# Altium schematic sheet Sheet1.SchDoc
size 381 x 241 mm; SheetNumber: 1; SheetTotal: 1
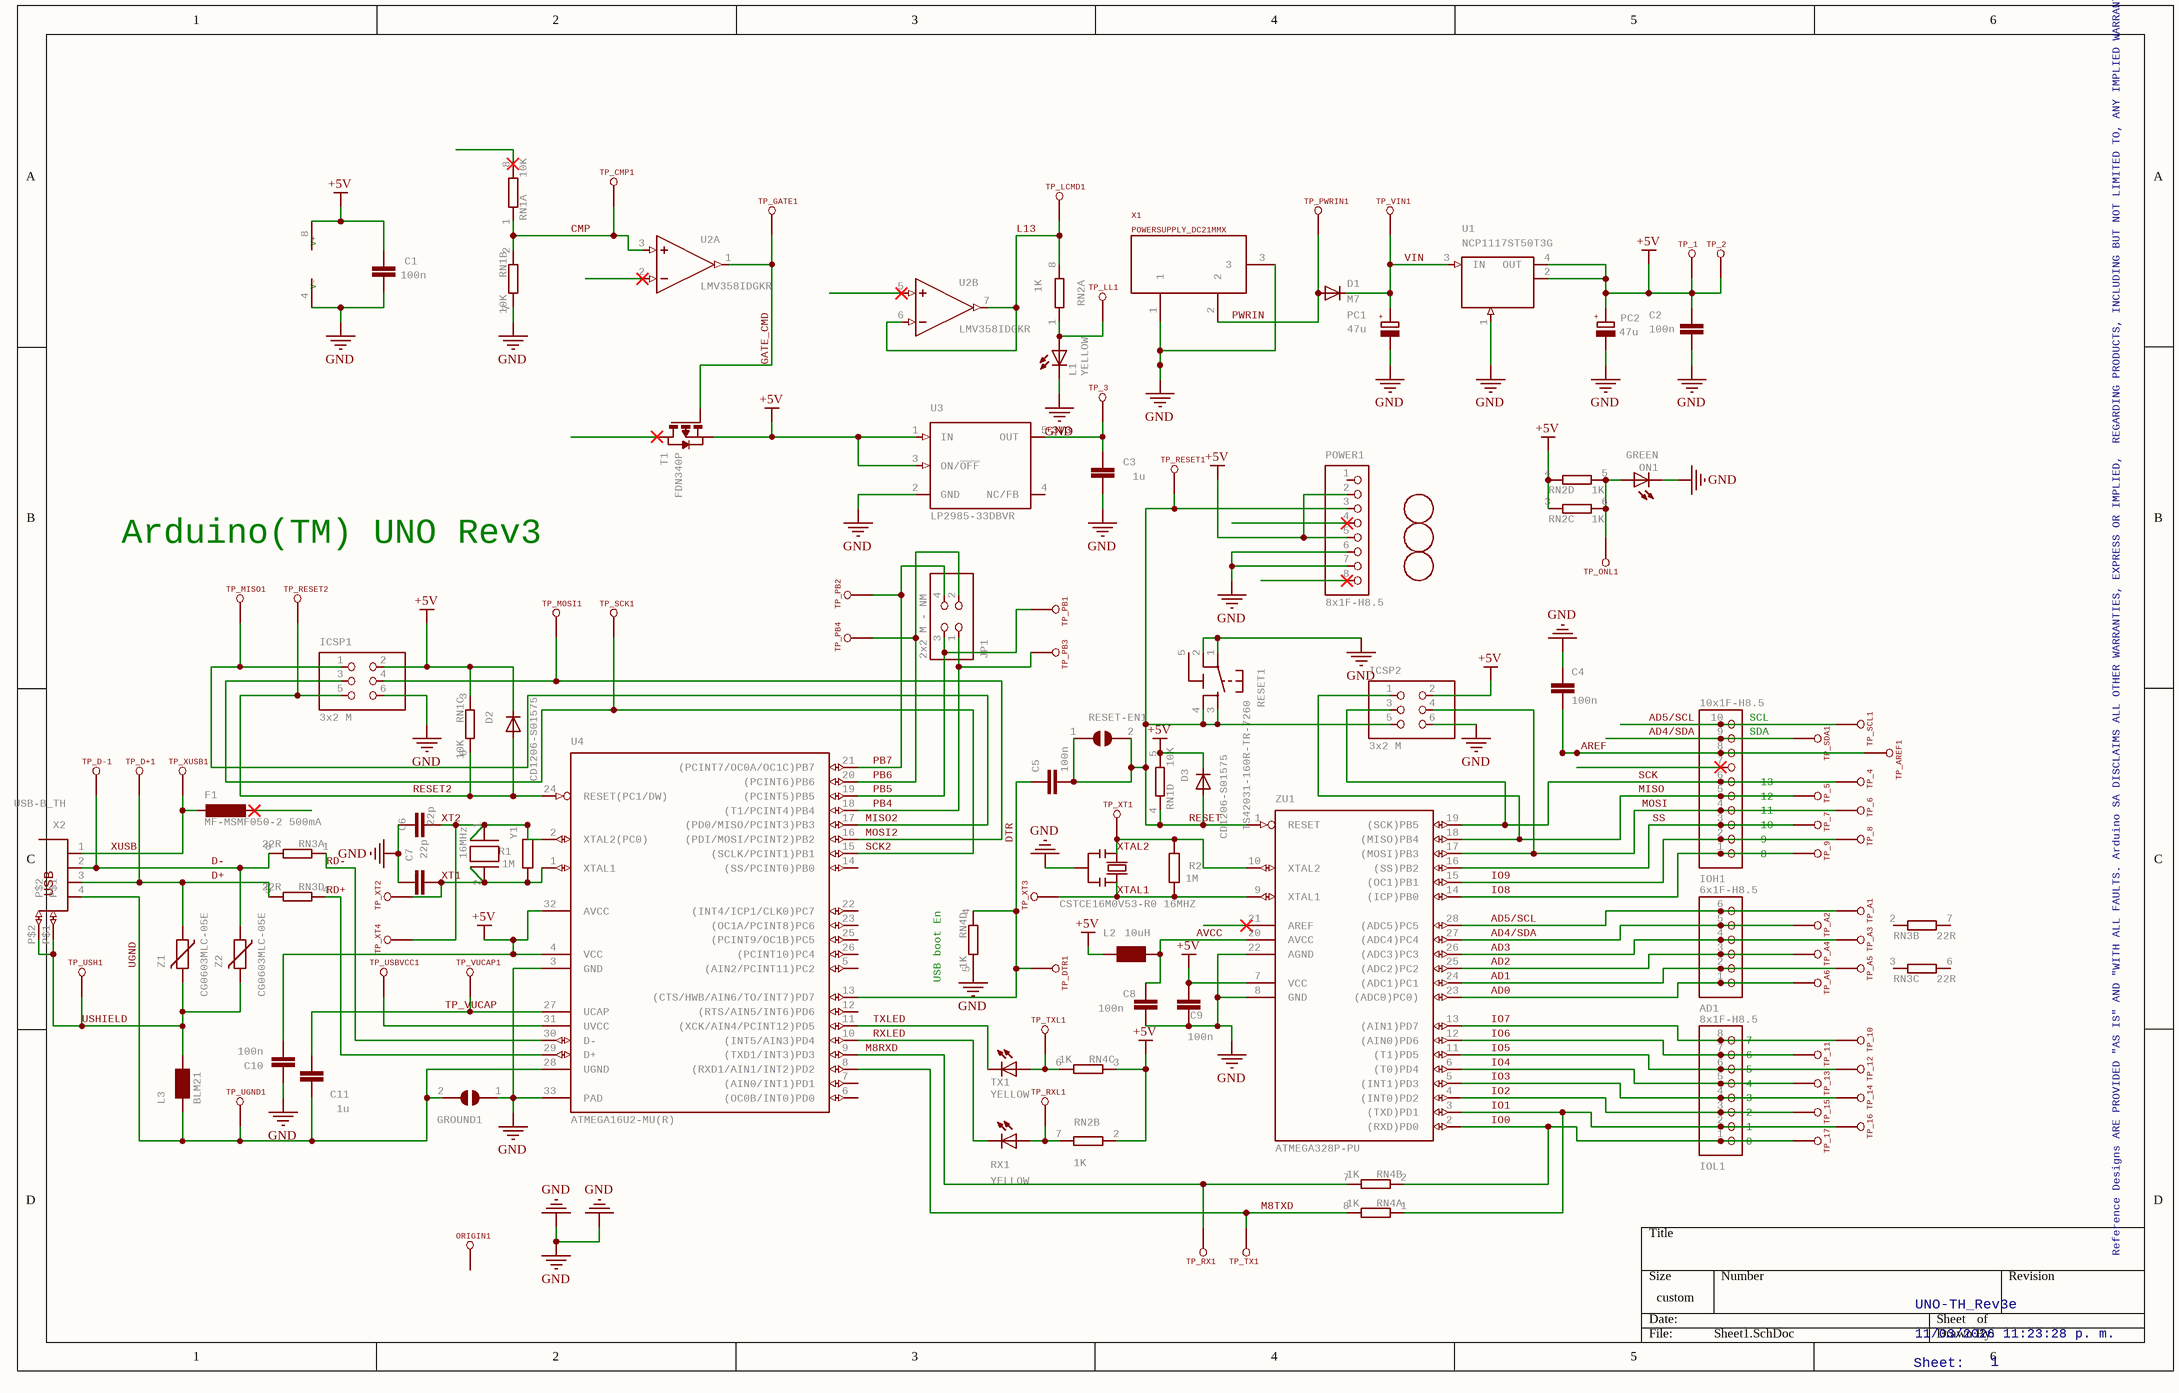
[diagram p0: Sheet1.SchDoc]

## Parts
AD1  6x1F-H8.5  [1X06]
C1  100n  [C0603-ROUND]
C2  100n  [C0603-ROUND]
C3  1u  [C0603-ROUND]
C4  100n  [C0603-ROUND]
C5  100n  [C0603-ROUND]
C6  22p  [C0603-ROUND]
C7  22p  [C0603-ROUND]
C8  100n  [C0603-ROUND]
C9  100n  [C0603-ROUND]
C10  100n  [C0603-ROUND]
C11  1u  [C0603-ROUND]
D1  M7  [SMB]
D2  CD1206-S01575  [MINIMELF]
D3  CD1206-S01575  [MINIMELF]
F1  MF-MSMF050-2 500mA  [L1812]
FD1  FIDUCIALMOUNT  [FIDUCIA-MOUNT]  (value not drawn)
FD2  FIDUCIALMOUNT  [FIDUCIA-MOUNT]  (value not drawn)
FD3  FIDUCIALMOUNT  [FIDUCIA-MOUNT]  (value not drawn)
GROUND1  SJ  [SJ]  (value not drawn)
ICSP1  3x2 M  [2X03]
ICSP2  3x2 M  [2X03]
IOH1  10x1F-H8.5  [1X10]
IOL1  8x1F-H8.5  [1X08]
JP1  2x2 M - NM  [2X02]
L1  YELLOW  [CHIP-LED0805]
L2  10uH  [0805]
L3  BLM21  [0805]
ON1  GREEN  [CHIP-LED0805]
ORIGIN1  TP_SP  [TP-SP]  (value not drawn)
PC1  47u  [PANASONIC_D]
PC2  47u  [PANASONIC_D]
POWER1  8x1F-H8.5  [1X08]
R1  1M  [R0603-ROUND]
R2  1M  [R0603-ROUND]
RESET1  TS42031-160R-TR-7260  [TS42]
RESET-EN1  SJ  [SJ]  (value not drawn)
RN1  10K  [CAY16]  (parts A,B,C,D of 4)
RN2  1K  [CAY16]  (parts A,B,C,D of 4)
RN3  22R  [CAY16]  (parts A,B,C,D of 4)
RN4  1K  [CAY16]  (parts A,B,C,D of 4)
RX1  YELLOW  [CHIP-LED0805]
T1  FDN340P  [SOT-23]
TP_1  TP_SP  [TP-SP]  (value not drawn)
TP_2  TP_SP  [TP-SP]  (value not drawn)
TP_3  TP_SP  [TP-SP]  (value not drawn)
TP_4  TP_SP  [TP-SP]  (value not drawn)
TP_5  TP_SP  [TP-SP]  (value not drawn)
TP_6  TP_SP  [TP-SP]  (value not drawn)
TP_7  TP_SP  [TP-SP]  (value not drawn)
TP_8  TP_SP  [TP-SP]  (value not drawn)
TP_9  TP_SP  [TP-SP]  (value not drawn)
TP_10  TP_SP  [TP-SP]  (value not drawn)
TP_11  TP_SP  [TP-SP]  (value not drawn)
TP_12  TP_SP  [TP-SP]  (value not drawn)
TP_13  TP_SP  [TP-SP]  (value not drawn)
TP_14  TP_SP  [TP-SP]  (value not drawn)
TP_15  TP_SP  [TP-SP]  (value not drawn)
TP_16  TP_SP  [TP-SP]  (value not drawn)
TP_17  TP_SP  [TP-SP]  (value not drawn)
TP_A1  TP_SP  [TP-SP]  (value not drawn)
TP_A2  TP_SP  [TP-SP]  (value not drawn)
TP_A3  TP_SP  [TP-SP]  (value not drawn)
TP_A4  TP_SP  [TP-SP]  (value not drawn)
TP_A5  TP_SP  [TP-SP]  (value not drawn)
TP_A6  TP_SP  [TP-SP]  (value not drawn)
TP_AREF1  TP_SP  [TP-SP]  (value not drawn)
TP_CMP1  TP_SP  [TP-SP]  (value not drawn)
TP_D+1  TP_SP  [TP-SP]  (value not drawn)
TP_D-1  TP_SP  [TP-SP]  (value not drawn)
TP_DTR1  TP_SP  [TP-SP]  (value not drawn)
TP_GATE1  TP_SP  [TP-SP]  (value not drawn)
TP_LCMD1  TP_SP  [TP-SP]  (value not drawn)
TP_LL1  TP_SP  [TP-SP]  (value not drawn)
TP_MISO1  TP_SP  [TP-SP]  (value not drawn)
TP_MOSI1  TP_SP  [TP-SP]  (value not drawn)
TP_ONL1  TP_SP  [TP-SP]  (value not drawn)
TP_PB1  TP_SP  [TP-SP]  (value not drawn)
TP_PB2  TP_SP  [TP-SP]  (value not drawn)
TP_PB3  TP_SP  [TP-SP]  (value not drawn)
TP_PB4  TP_SP  [TP-SP]  (value not drawn)
TP_PWRIN1  TP_SP  [TP-SP]  (value not drawn)
TP_RESET1  TP_SP  [TP-SP]  (value not drawn)
TP_RESET2  TP_SP  [TP-SP]  (value not drawn)
TP_RX1  TP_SP  [TP-SP]  (value not drawn)
TP_RXL1  TP_SP  [TP-SP]  (value not drawn)
TP_SCK1  TP_SP  [TP-SP]  (value not drawn)
TP_SCL1  TP_SP  [TP-SP]  (value not drawn)
TP_SDA1  TP_SP  [TP-SP]  (value not drawn)
TP_TX1  TP_SP  [TP-SP]  (value not drawn)
TP_TXL1  TP_SP  [TP-SP]  (value not drawn)
TP_UGND1  TP_SP  [TP-SP]  (value not drawn)
TP_USBVCC1  TP_SP  [TP-SP]  (value not drawn)
TP_USH1  TP_SP  [TP-SP]  (value not drawn)
TP_VIN1  TP_SP  [TP-SP]  (value not drawn)
TP_VUCAP1  TP_SP  [TP-SP]  (value not drawn)
TP_XT1  TP_SP  [TP-SP]  (value not drawn)
TP_XT2  TP_SP  [TP-SP]  (value not drawn)
TP_XT3  TP_SP  [TP-SP]  (value not drawn)
TP_XT4  TP_SP  [TP-SP]  (value not drawn)
TP_XUSB1  TP_SP  [TP-SP]  (value not drawn)
TX1  YELLOW  [CHIP-LED0805]
U1  NCP1117ST50T3G  [SOT223]
U2  LMV358IDGKR  [MSOP08]  (parts A,B,C of 3)
U3  LP2985-33DBVR  [SOT23-DBV]
U4  ATMEGA16U2-MU(R)  [MLF32]
X1  POWERSUPPLY_DC21MMX  [POWERSUPPLY_DC-21MM]
X2  USB-B_TH  [PN61729]
Y1  16MHz  [QS]
Y2  CSTCE16M0V53-R0 16MHZ  [RESONATOR]
Z1  CG0603MLC-05E  [CT/CN0603]
Z2  CG0603MLC-05E  [CT/CN0603]
ZU1  ATMEGA328P-PU  [DIL28-3]

## Nets
+5V: C1.2 C2.2 C9.2 C10.1 D2.C D3.C ICSP1.2 ICSP2.2 L2.1 PC2.+ POWER1.2 POWER1.5 RN1.3 RN1.5 RN2.2 RN2.3 RN2.4 RN4.3 T1.2(S) TP_1.X(TESTP) TP_2.X(TESTP) U1.2(OUT) U1.4(OUT) U2.8(V+) U3.1(IN) U3.3(ON/~{OFF}) U4.4(VCC) U4.32(AVCC) ZU1.7(VCC)
GND: C1.1 C2.1 C3.1 C4.1 C6.2 C7.2 C8.1 C9.1 C10.2 GROUND1.1 ICSP1.6 ICSP2.6 L1.C ON1.C PC1.- PC2.- POWER1.6 POWER1.7 RESET1.1 RESET1.2 RN1.7 RN4.5 U1.1(GND/ADJ) U2.4(V-) U3.2(GND) U4.3(GND) U4.33(PAD) X1.1 X1.3 Y2.2 ZU1.8(GND) ZU1.22(AGND)
+3V3: C3.2 TP_3.X(TESTP) U3.5(OUT)
AD0: AD1.1 TP_A6.X(TESTP) ZU1.23((ADC0)PC0))
AD1: AD1.2 TP_A5.X(TESTP) ZU1.24((ADC1)PC1)
AD2: AD1.3 TP_A4.X(TESTP) ZU1.25((ADC2)PC2)
AD3: AD1.4 TP_A3.X(TESTP) ZU1.26((ADC3)PC3)
AD4/SDA: AD1.5 IOH1.9 TP_A2.X(TESTP) TP_SDA1.X(TESTP) ZU1.27((ADC4)PC4)
AD5/SCL: AD1.6 IOH1.10 TP_A1.X(TESTP) TP_SCL1.X(TESTP) ZU1.28((ADC5)PC5)
AREF: C4.2 IOH1.8 TP_AREF1.X(TESTP)
AVCC: C8.2 L2.2 ZU1.20(AVCC)
CMP: RN1.1 RN1.2 TP_CMP1.X(TESTP) U2.3(+IN)
D+: RN3.5 TP_D+1.X(TESTP) X2.3 Z1.1
D-: RN3.8 TP_D-1.X(TESTP) X2.2 Z2.1
DTR: C5.1 RN4.4 TP_DTR1.X(TESTP) U4.13((CTS/HWB/AIN6/TO/INT7)PD7)
GATE_CMD: T1.3(G) TP_GATE1.X(TESTP) U2.1(OUT)
IO0: IOL1.1 RN4.2 TP_17.X(TESTP) ZU1.2((RXD)PD0)
IO1: IOL1.2 RN4.1 TP_16.X(TESTP) ZU1.3((TXD)PD1)
IO2: IOL1.3 TP_15.X(TESTP) ZU1.4((INT0)PD2)
IO3: IOL1.4 TP_14.X(TESTP) ZU1.5((INT1)PD3)
IO4: IOL1.5 TP_13.X(TESTP) ZU1.6((T0)PD4)
IO5: IOL1.6 TP_12.X(TESTP) ZU1.11((T1)PD5)
IO6: IOL1.7 TP_11.X(TESTP) ZU1.12((AIN0)PD6)
IO7: IOL1.8 TP_10.X(TESTP) ZU1.13((AIN1)PD7)
IO8: IOH1.1 TP_9.X(TESTP) ZU1.14((ICP)PB0)
IO9: IOH1.2 TP_8.X(TESTP) ZU1.15((OC1)PB1)
L13: RN2.8 TP_LCMD1.X(TESTP) U2.6(-IN) U2.7(OUT)
M8RXD: RN4.7 TP_RX1.X(TESTP) U4.9((TXD1/INT3)PD3)
M8TXD: RN4.8 TP_TX1.X(TESTP) U4.8((RXD1/AIN1/INT2)PD2)
MISO: ICSP2.1 IOH1.5 TP_5.X(TESTP) ZU1.18((MISO)PB4)
MISO2: ICSP1.1 TP_MISO1.X(TESTP) U4.17((PD0/MISO/PCINT3)PB3)
MOSI: ICSP2.4 IOH1.4 TP_6.X(TESTP) ZU1.17((MOSI)PB3)
MOSI2: ICSP1.4 TP_MOSI1.X(TESTP) U4.16((PDI/MOSI/PCINT2)PB2)
PB4: JP1.1 TP_PB3.X(TESTP) U4.18((T1/PCINT4)PB4)
PB5: JP1.3 TP_PB1.X(TESTP) U4.19((PCINT5)PB5)
PB6: JP1.2 TP_PB4.X(TESTP) U4.20((PCINT6)PB6)
PB7: JP1.4 TP_PB2.X(TESTP) U4.21((PCINT7/OC0A/OC1C)PB7)
PWRIN: D1.A TP_PWRIN1.X(TESTP) X1.2
RD+: RN3.4 U4.29(D+)
RD-: RN3.1 U4.30(D-)
RESET: C5.2 D3.A ICSP2.5 POWER1.3 RESET1.3 RESET1.4 RESET-EN1.1 RESET-EN1.2 RN1.4 TP_RESET1.X(TESTP) ZU1.1(RESET)
RESET2: D2.A ICSP1.5 RN1.6 TP_RESET2.X(TESTP) U4.24(RESET(PC1/DW))
RXLED: RX1.C U4.10((INT5/AIN3)PD4)
SCK: ICSP2.3 IOH1.6 TP_4.X(TESTP) ZU1.19((SCK)PB5)
SCK2: ICSP1.3 TP_SCK1.X(TESTP) U4.15((SCLK/PCINT1)PB1)
SS: IOH1.3 TP_7.X(TESTP) ZU1.16((SS)PB2)
TP_VUCAP: C11.1 TP_VUCAP1.X(TESTP) U4.27(UCAP)
TXLED: TX1.C U4.11((XCK/AIN4/PCINT12)PD5)
UGND: C11.2 GROUND1.2 L3.1 TP_UGND1.X(TESTP) U4.28(UGND) X2.4
USHIELD: L3.2 TP_USH1.X(TESTP) X2.P$1 X2.P$2 Z1.2 Z2.2
VIN: D1.C PC1.+ TP_VIN1.X(TESTP) U1.3(IN)
XT1: C7.1 R1.1 TP_XT2.X(TESTP) U4.1(XTAL1) Y1.2
XT2: C6.1 R1.2 TP_XT4.X(TESTP) U4.2(XTAL2(PC0)) Y1.1
XTAL1: R2.1 TP_XT3.X(TESTP) Y2.3 ZU1.9(XTAL1)
XTAL2: R2.2 TP_XT1.X(TESTP) Y2.1 ZU1.10(XTAL2)
XUSB: F1.2 TP_XUSB1.X(TESTP) X2.1
NetL1_A: L1.A RN2.1 TP_LL1.X(TESTP)
NetON1_A: ON1.A RN2.5 RN2.6 TP_ONL1.X(TESTP)
NetRN2_7: RN2.7 RX1.A TP_RXL1.X(TESTP)
NetRN4_6: RN4.6 TP_TXL1.X(TESTP) TX1.A
NetTP_USBVCC1_X: TP_USBVCC1.X(TESTP) U4.31(UVCC)

Not connected (* = marked no-connect by the designer): F1 1*; IOH1 7*; ORIGIN1 X(TESTP); POWER1 1 4* 8*; RESET1 5(5-GND); RN1 8(2)*; RN3 2(1) 3(1) 6(2) 7(2); T1 1(D)*; U2 2(-IN)* 5(+IN)*; U3 4(NC/FB); U4 5((AIN2/PCINT11)PC2) 6((OC0B/INT0)PD0) 7((AIN0/INT1)PD1) 12((RTS/AIN5/INT6)PD6) 14((SS/PCINT0)PB0) 22((INT4/ICP1/CLK0)PC7) 23((OC1A/PCINT8)PC6) 25((PCINT9/OC1B)PC5) 26((PCINT10)PC4); ZU1 21(AREF)*

## Notes on the sheet
- Arduino(TM) UNO Rev3
- (near IOH1) SDA
- (near IOH1) SCL
- (near IOH1) 10
- (near IOH1) 11
- (near IOH1) 12
- (near IOH1) 13
- (near IOH1) 8
- (near IOH1) 9
- (near RN4) USB boot En
- (near IOL1) 2
- (near IOL1) 3
- (near IOL1) 4
- (near IOL1) 5
- (near IOL1) 6
- (near IOL1) 7
- (near IOL1) 0
- (near IOL1) 1
- Reference Designs ARE PROVIDED "AS IS" AND "WITH ALL FAULTS. Arduino SA DISCLAIMS ALL OTHER WARRANTIES, EXPRESS OR IMPLIED,
  REGARDING PRODUCTS, INCLUDING BUT NOT LIMITED TO, ANY IMPLIED WARRANTIES OF MERCHANTABILITY OR FITNESS FOR A PARTICULAR PURPOSE
  Arduino SA may make changes to specifications and product descriptions at any time, without notice. The Customer must not
  rely on the absence or characteristics of any features or instructions marked "reserved" or "undefined." Arduino SA reserves
  these for future definition and shall have no responsibility whatsoever for conflicts or incompatibilities arising from future changes to them.
  The product information on the Web Site or Materials is subject to change without notice. Do not finalize a design with this info
  ARDUINO and other Arduino brands and logos and Trademarks of Arduino SA. All Arduino SA Trademarks cannot be used without owner's formal permission
- UNO-TH_Rev3e
- Sheet:
- 11/03/2026 11:23:28 p. m.
- 1

## Library data of the parts
AD1 = PINHD-1X6: PIN HEADER; GateName_1: A; SymbolName_1: PINHD6; LibraryName: SmartPrj; DeviceSetName: PINHD-1X6
C1-C11 = C-EU0603-RND: CAPACITOR, European symbol; GateName_1: G$1; SymbolName_1: C-EU; DeviceName: 0603-RND; LibraryName: SmartPrj; DeviceSetName: C-EU
D1 = DIODE-SMB: DIODE; GateName_1: G$1; SymbolName_1: D; DeviceSetName: DIODE-; DeviceName: SMB; LibraryName: diode
D2 D3 = DIODE-MINIMELF: DIODE; GateName_1: G$1; SymbolName_1: D; DeviceSetName: DIODE-; DeviceName: MINIMELF; LibraryName: diode
F1 = L-EUL1812: INDUCTOR, European symbol; GateName_1: G$1; SymbolName_1: L-EU; DeviceName: L1812; LibraryName: rcl; DeviceSetName: L-EU
FD1-FD3 = FIDUCIALMOUNT: GateName_1: G$1; SymbolName_1: FIDUCIAL; LibraryName: SmartPrj; DeviceSetName: FIDUCIALMOUNT
GROUND1 RESET-EN1 = SJ: SMD solder JUMPER; GateName_1: 1; SymbolName_1: SJ; LibraryName: jumper; DeviceSetName: SJ
ICSP1 ICSP2 = PINHD-2X3: PIN HEADER; GateName_1: A; SymbolName_1: PINH2X3; LibraryName: SmartPrj; DeviceSetName: PINHD-2X3
IOH1 = PINHD-1X10_ARD: PIN HEADER; GateName_1: A; SymbolName_1: PINHD10; LibraryName: SmartPrj; DeviceSetName: PINHD-1X10_ARD
IOL1 POWER1 = PINHD-1X8: PIN HEADER; GateName_1: A; SymbolName_1: PINHD8; LibraryName: SmartPrj; DeviceSetName: PINHD-1X8
JP1 = PINHD-2X2: PIN HEADER; GateName_1: A; SymbolName_1: PINH2X2; LibraryName: SmartPrj; DeviceSetName: PINHD-2X2
L1 ON1 RX1 TX1 = LEDCHIP-LED0805: LED   OSRAM: - CHIPLED LG R971, LG N971, LY N971, LG Q971, LY Q971, LO R971, LY R971 LH N974, LH R974 LS Q976, LO Q976, LY Q976 LO Q996 - Hyper CHIPLED LW Q18S LB Q993, LB Q99A, LB R99A - SideLED LS A670, LO A670, LY A670, LG A670, LP A670 LB A673, LV A673, LT A673, LW A673 LH A674 LY A675 LS A676, LA A676, LO A676, LY A676, LW A676 LS A679, LY A679, LG A679 -  Hyper Micro SIDELEDÂ® LS Y876, LA Y876, LO Y876, LY Y876 LT Y87S - SmartLED LW L88C, LW L88S LB L89C, LB L89S, LG L890 LS L89K, LO L89K, LY L89K LS L896, LA L896, LO L896, LY L896 - TOPLED LS T670, LO T670, LY T670, LG T670, LP T670 LSG T670, LSP T670, LSY T670, LOP T670, LYG T670 LG T671, LOG T671, LSG T671 LB T673, LV T673, LT T673, LW T673 LH T674 LS T676, LA T676, LO T676, LY T676, LB T676, LH T676, LSB T676, LW T676 LB T67C, LV T67C, LT T67C, LS T67K, LO T67K, LY T67K, LW E67C LS E67B, LA E67B, LO E67B, LY E67B, LB E67C, LV E67C, LT E67C LW T67C LS T679, LY T679, LG T679 LS T770, LO T770, LY T770, LG T770, LP T770 LB T773, LV T773, LT T773, LW T773 LH T774 LS E675, LA E675, LY E675, LS T675 LS T776, LA T776, LO T776, LY T776, LB T776 LHGB T686 LT T68C, LB T68C - Hyper Mini TOPLEDÂ® LB M676 - Mini TOPLED SantanaÂ® LG M470 LS M47K, LO M47K, LY M47K    Source: http://www.osram.convergy.de   LUXEON: - LUMILEDÂ® LXK2-PW12-R00, LXK2-PW12-S00, LXK2-PW14-U00, LXK2-PW14-V00 LXK2-PM12-R00, LXK2-PM12-S00, LXK2-PM14-U00 LXK2-PE12-Q00, LXK2-PE12-R00, LXK2-PE12-S00, LXK2-PE14-T00, LXK2-PE14-U00 LXK2-PB12-K00, LXK2-PB12-L00, LXK2-PB12-M00, LXK2-PB14-N00, LXK2-PB14-P00, LXK2-PB14-Q00 LXK2-PR12-L00, LXK2-PR12-M00, LXK2-PR14-Q00, LXK2-PR14-R00 LXK2-PD12-Q00, LXK2-PD12-R00, LXK2-PD12-S00 LXK2-PH12-R00, LXK2-PH12-S00 LXK2-PL12-P00, LXK2-PL12-Q00, LXK2-PL12-R00    Source: www.luxeon.com   KINGBRIGHT:   KA-3528ASYC Source: www.kingbright.com; GateName_1: G$1; SymbolName_1: LED; DeviceName: CHIP-LED0805; LibraryName: led; DeviceSetName: LED
L2 = 0715_CV201210-100K: 10uH 0805; GateName_1: G$1; SymbolName_1: L; MONTHLY_USAGE: _____; TYPE: Induttanze; LibraryName: Induttanze; DeviceSetName: 0715_CV201210-100K; CASE: 0805; PART_NUMBER: CV201210-100K; PRICE: _____; SUPPLIER: _____
L3 = WE-CBF_0805: SMD EMI Suppression Ferrite Beads - excellent anti-EMI properties - low DCR - impedances till 3000 ohms - rated current up to 6 A; GateName_1: G$1; SymbolName_1: L; DeviceName: _0805; DeviceSetName: WE-CBF; LibraryName: wuerth-elektronik
ORIGIN1 TP_1-TP_17 TP_A1-TP_A6 TP_AREF1 TP_CMP1 TP_D+1 TP_D-1 TP_DTR1 TP_GATE1 TP_LCMD1 TP_LL1 TP_MISO1 TP_MOSI1 TP_ONL1 TP_PB1-TP_PB4 TP_PWRIN1 TP_RESET1 TP_RESET2 TP_RX1 TP_RXL1 TP_SCK1 TP_SCL1 TP_SDA1 TP_TX1 TP_TXL1 TP_UGND1 TP_USBVCC1 TP_USH1 TP_VIN1 TP_VUCAP1 TP_XT1-TP_XT4 TP_XUSB1 = TP_SP: GateName_1: G$1; SymbolName_1: TP-SP; LibraryName: SmartPrj; DeviceSetName: TP_SP
PC1 PC2 = CPOL-EUD: POLARIZED CAPACITOR, European symbol; GateName_1: G$1; SymbolName_1: CPOL; DeviceName: D; LibraryName: rcl; DeviceSetName: CPOL-EU; +: +
R1 R2 = R-EU_R0603: RESISTOR, European symbol; GateName_1: G$1; SymbolName_1: R-EU; DeviceName: R0603; DeviceSetName: R-EU_; LibraryName: SmartPrj
RESET1 = TS42: TS42 Dongnan Electronics Tact switch VDC 12V - 50mA; GateName_1: G$1; SymbolName_1: ST-MOD_V1.4_TS42; LibraryName: SmartPrj; DeviceSetName: TS42
RN1-RN4 = 4R-NCAY16: Array Chip Resistor   Source: RS Component / Phycomp; GateName_1: A; SymbolName_1: R1NV; GateName_2: B; GateName_3: C; GateName_4: D; DeviceSetName: 4R-N; SymbolName_2: R1NV; SymbolName_3: R1NV; SymbolName_4: R1NV; DeviceName: CAY16; LibraryName: resistor-dil
T1 = PMOSSOT23: MOS FET; GateName_1: A; SymbolName_1: P_MOSFET; LibraryName: zetex; DeviceSetName: PMOSSOT23
U1 = MC33269ST*: Adjustable Output Low Dropout Voltage Regulator 800 mA   Source: http://www.onsemi.com/pub/Collateral/MC33269-D.PDF; GateName_1: G$1; SymbolName_1: VREG-O2; LibraryName: linear; DeviceSetName: MC33269ST*
U2 = LMV358?*MM: Dual General Purpose, Low Voltage, Rail-to-Rail Output Operational Amplifiers   Source: http://www.national.com/mpf/LM/LMV321.html http://www.national.com/dt/lmv_qual.pdf; GateName_1: A; SymbolName_1: OPAMP; GateName_2: B; GateName_3: P; SymbolName_3: PWR+-; DeviceName: MM; SymbolName_2: OPAMP; LibraryName: linear; DeviceSetName: LMV358?*
U3 = LP2985-XXDBVR: ULTRALOW-POWER 50-mA LOW-DROPOUT LINEAR REGULATORS   50-mA Low-Dropout Regulator Source: http://focus.ti.com/lit/ds/symlink/tps77001.pdf; GateName_1: G$1; SymbolName_1: LP2985-XXDBVR; LibraryName: SmartPrj; DeviceSetName: LP2985-XXDBVR
U4 = ATMEGA16U2-MU: GateName_1: G$1; SymbolName_1: ATMEL_MEGA8U2; DeviceName: MU; LibraryName: SmartPrj; DeviceSetName: ATMEGA16U2-
X1 = POWERSUPPLY_DC21MMX: GateName_1: G$1; SymbolName_1: POWERSUPPLY_DC21PWR; DeviceName: X; LibraryName: SmartPrj; DeviceSetName: POWERSUPPLY_DC21MM
X2 = PN61729: BERG USB connector; GateName_1: G$1; SymbolName_1: J11; LibraryName: SmartPrj; DeviceSetName: PN61729; USB: USB
Y1 = XTAL/S: CRYSTAL; GateName_1: G$1; SymbolName_1: XTAL; LibraryName: SmartPrj; DeviceSetName: XTAL/S
Y2 = RESONATORMU: GateName_1: G$1; DeviceName: MU; SymbolName_1: RESONATOR; LibraryName: SmartPrj; DeviceSetName: RESONATOR
Z1 Z2 = VARISTORCN0603: VARISTOR; GateName_1: G$1; DeviceName: CN0603; SymbolName_1: VARISTOR; LibraryName: varistor; DeviceSetName: VARISTOR
ZU1 = ATMEGA328P-PU: MICROCONTROLLER   4 Kbytes FLASH   128 bytes SRAM   256 bytes EEPROM   UART   6-channel 10 bit ADC; GateName_1: G$1; SymbolName_1: 20-I/O-2; DeviceName: PU; LibraryName: SmartPrj; DeviceSetName: ATMEGA328P-